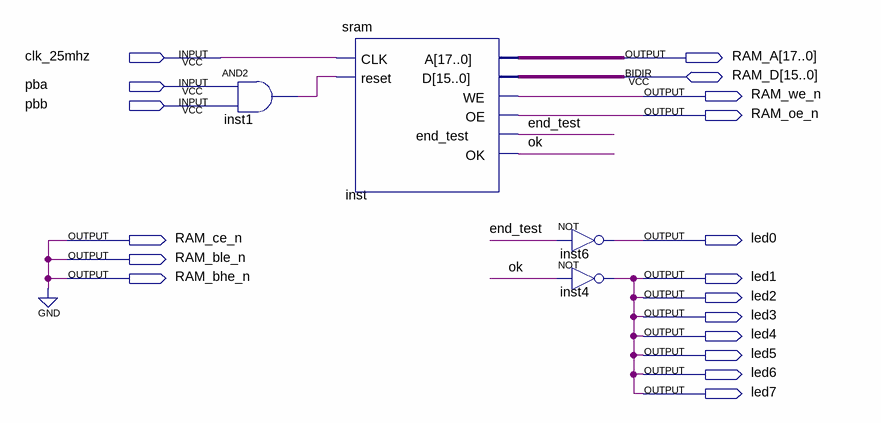
[diagram p0: schematic sheet]
// Quartus schematic test2.bdf as structural Verilog: 4 symbols, 18 pins
module test2 (
  input  clk_25mhz,
  input  pba,
  input  pbb,
  inout  [15:0] RAM_D,
  output [17:0] RAM_A,
  output RAM_we_n,
  output RAM_oe_n,
  output RAM_ce_n,
  output led0,
  output RAM_ble_n,
  output RAM_bhe_n,
  output led1,
  output led2,
  output led3,
  output led4,
  output led5,
  output led6,
  output led7
);

  wire end_test, inst1_out, ok;

  and inst1 (inst1_out, pba, pbb);
  sram inst (
    .CLK(clk_25mhz), .reset(inst1_out), .A(RAM_A), .WE(RAM_we_n), .OE(RAM_oe_n), .end_test(end_test),
    .OK(ok), .D(RAM_D));
  not inst6 (led0, end_test);
  not inst4 (led1, ok);

  assign led2 = led1;
  assign led3 = led1;
  assign led4 = led1;
  assign led5 = led1;
  assign led6 = led1;
  assign led7 = led1;
  assign RAM_bhe_n = 1'b0;
  assign RAM_ble_n = 1'b0;
  assign RAM_ce_n = 1'b0;
endmodule
